# Altium project lightSoakV1-InAmp-piggyback.PrjPcb
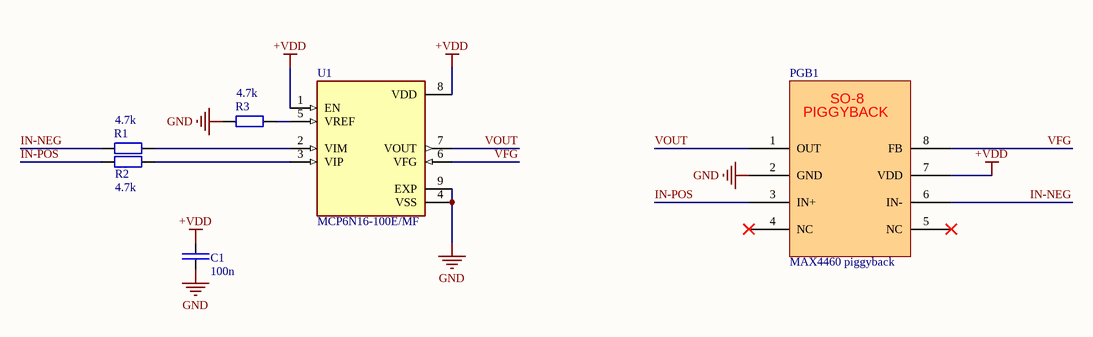
[diagram p0: lightSoakV1-InAmp-piggyback-sch.SchDoc]
2 sheets, 15 parts. Net scope: global (net labels, ports and power ports of the same name join across sheets).
Board file: lightSoakV1-InAmp-piggyback-PCB.PcbDoc
Sheets:
  lightSoakV1-InAmp-piggyback-sch.SchDoc
  testtest.SchDoc

## Sheet lightSoakV1-InAmp-piggyback-sch.SchDoc
size A4; SheetNumber: 1; SheetTotal: 1

### Parts
C1  value 100n  [FPR_0402_C_R0]  (hidden comment: PN_C_100n)
PGB1  MAX4460 piggyback  [SO-8 piggyback]
R1  value 4.7k  [FPR_0402_R_R0]  (hidden comment: PN_R_4k7)
R2  value 4.7k  [FPR_0402_R_R0]  (hidden comment: PN_R_4k7)
R3  value 4.7k  [FPR_0402_R_R0]  (hidden comment: PN_R_4k7)
U1  MCP6N16-100E/MF  [SON65P300X300X100-9N]

### Nets
+VDD: C1.2 PGB1.7(VDD) U1.1(EN) U1.8(VDD)
GND: C1.1 PGB1.2(GND) R3.2 U1.4(VSS) U1.9(EXP)
IN-NEG: PGB1.6(IN-) R1.2
IN-POS: PGB1.3(IN+) R2.2
VFG: PGB1.8(FB) U1.6(VFG)
VOUT: PGB1.1(OUT) U1.7(VOUT)
NetR1_1: R1.1 U1.2(VIM)
NetR2_1: R2.1 U1.3(VIP)
NetR3_1: R3.1 U1.5(VREF)

Not connected (* = marked no-connect by the designer): PGB1 4(NC)* 5(NC)*

### Notes on the sheet
- (in symbol MAX4460 piggyback) SO-8; PIGGYBACK

### Library data of the parts
C1 = C: Capacitor - generic SMD
R1-R3 = R: Resistor - generic SMD
U1 = MCP6N16-100E/MF: Instrumentation Amplifier 1 Circuit Rail-to-Rail 8-DFN-EP (3x3); MF: Microchip; MP: MCP6N16-100E/MF; Package: DFN-8 Microchip; Availability: In Stock; Price: None; Purchase-URL: https://pricing.snapeda.com/search/part/MCP6N16-100E/MF/?ref=eda; Check_prices: https://www.snapeda.com/parts/MCP6N16-100E/MF/Microchip/view-part/?ref=eda; SnapEDA_Link: https://www.snapeda.com/parts/MCP6N16-100E/MF/Microchip/view-part/?ref=snap; Value: *

## Sheet testtest.SchDoc
size A4; SheetNumber: 2; SheetTotal: 2
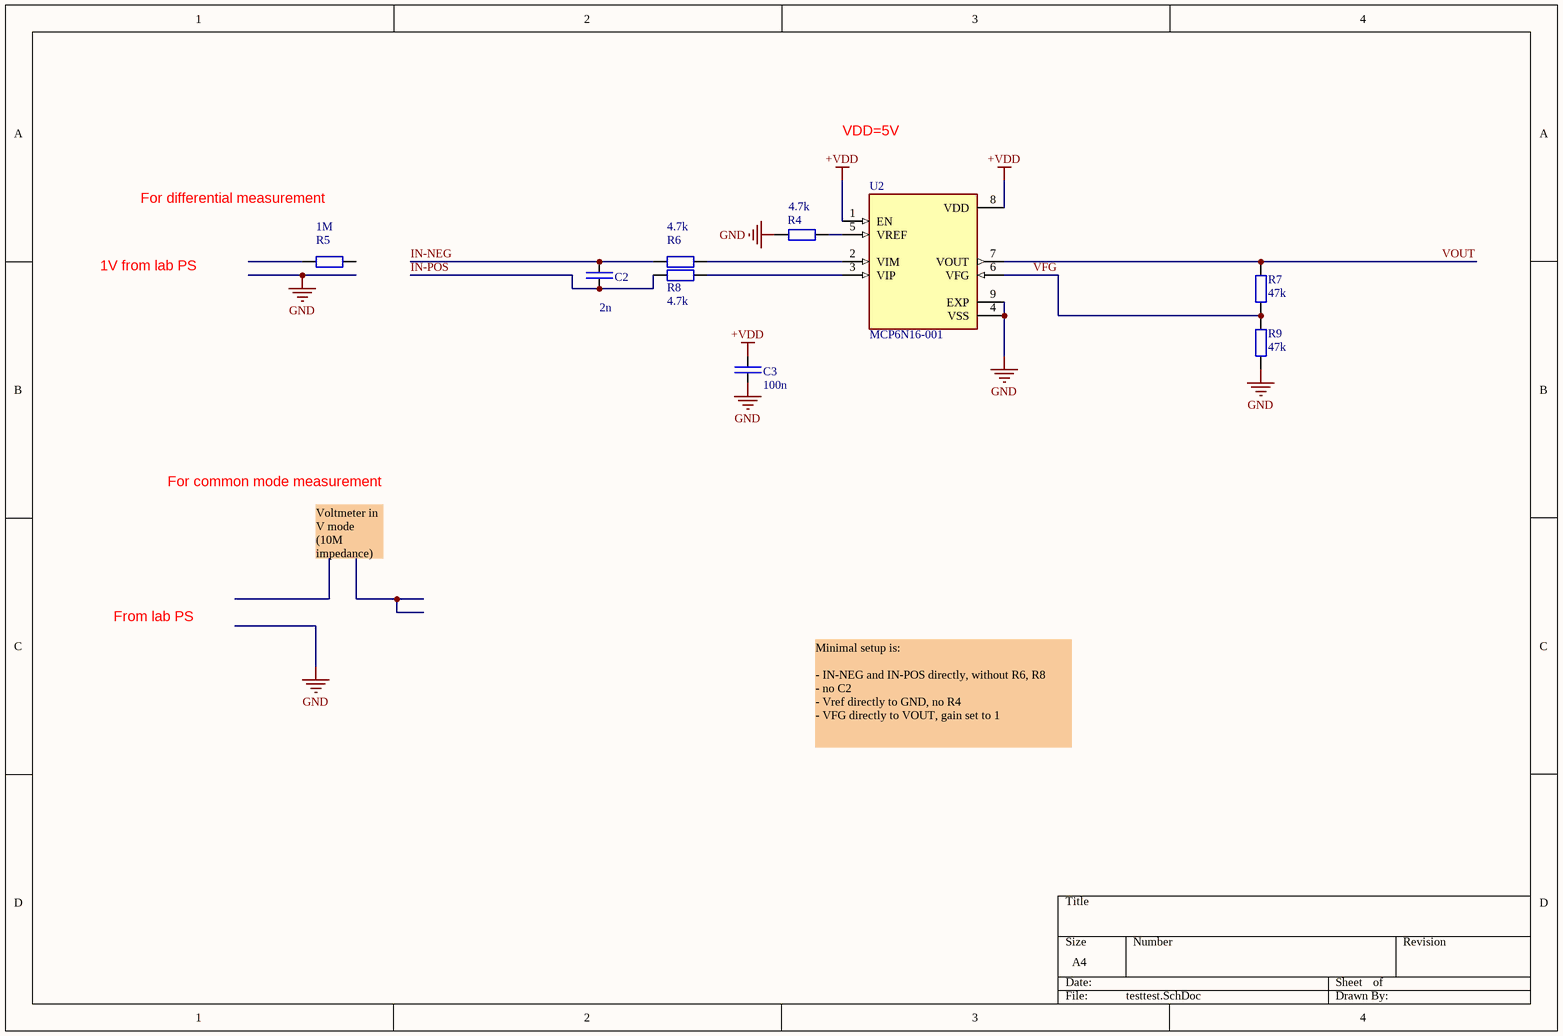
[diagram p1: testtest.SchDoc]

### Parts
C2  value 2n  [FPR_0402_C_R0]  (hidden comment: PN_C_100n)
C3  value 100n  [FPR_0402_C_R0]  (hidden comment: PN_C_100n)
R4  value 4.7k  [FPR_0402_R_R0]  (hidden comment: PN_R_4k7)
R5  value 1M  [FPR_0402_R_R0]  (hidden comment: PN_R_4k7)
R6  value 4.7k  [FPR_0402_R_R0]  (hidden comment: PN_R_4k7)
R7  value 47k  [FPR_0402_R_R0]  (hidden comment: PN_R_4k7)
R8  value 4.7k  [FPR_0402_R_R0]  (hidden comment: PN_R_4k7)
R9  value 47k  [FPR_0402_R_R0]  (hidden comment: PN_R_4k7)
U2  MCP6N16-001  [SON65P300X300X100-9N]

### Nets
+VDD: C3.2 U2.1(EN) U2.8(VDD)
GND: C3.1 R4.2 R9.2 U2.4(VSS) U2.9(EXP)
IN-NEG: C2.2 R6.2
IN-POS: C2.1 R8.2
VFG: R7.2 R9.1 U2.6(VFG)
VOUT: R7.1 U2.7(VOUT)
NetR4_1: R4.1 U2.5(VREF)
NetR6_1: R6.1 U2.2(VIM)
NetR8_1: R8.1 U2.3(VIP)

Not connected (* = marked no-connect by the designer): R5 1 2

### Notes on the sheet
- VDD=5V
- For differential measurement
- 1V from lab PS
- For common mode measurement
- Voltmeter in V mode (10M impedance)
- From lab PS
- Minimal setup is:
  - IN-NEG and IN-POS directly, without R6, R8
  - no C2
  - Vref directly to GND, no R4
  - VFG directly to VOUT, gain set to 1

### Library data of the parts
C2 C3 = C: Capacitor - generic SMD
R4-R9 = R: Resistor - generic SMD
U2 = MCP6N16-100E/MF: as U1 on sheet lightSoakV1-InAmp-piggyback-sch; MP: MCP6N16-100E/MF; Package: DFN-8 Microchip; Availability: In Stock; Price: None; Purchase-URL: https://pricing.snapeda.com/search/part/MCP6N16-100E/MF/?ref=eda; Check_prices: https://www.snapeda.com/parts/MCP6N16-100E/MF/Microchip/view-part/?ref=eda; SnapEDA_Link: https://www.snapeda.com/parts/MCP6N16-100E/MF/Microchip/view-part/?ref=snap; Value: *

## Nets that join several sheets
+VDD: lightSoakV1-InAmp-piggyback-sch (C1.2 PGB1.7 U1.1 U1.8), testtest (C3.2 U2.1 U2.8)
GND: lightSoakV1-InAmp-piggyback-sch (5 pins), testtest (5 pins)
IN-NEG: lightSoakV1-InAmp-piggyback-sch (PGB1.6 R1.2), testtest (C2.2 R6.2)
IN-POS: lightSoakV1-InAmp-piggyback-sch (PGB1.3 R2.2), testtest (C2.1 R8.2)
VFG: lightSoakV1-InAmp-piggyback-sch (PGB1.8 U1.6), testtest (R7.2 R9.1 U2.6)
VOUT: lightSoakV1-InAmp-piggyback-sch (PGB1.1 U1.7), testtest (R7.1 U2.7)